# EAGLE design PasswordKeeper (EAGLE 7.6.0)
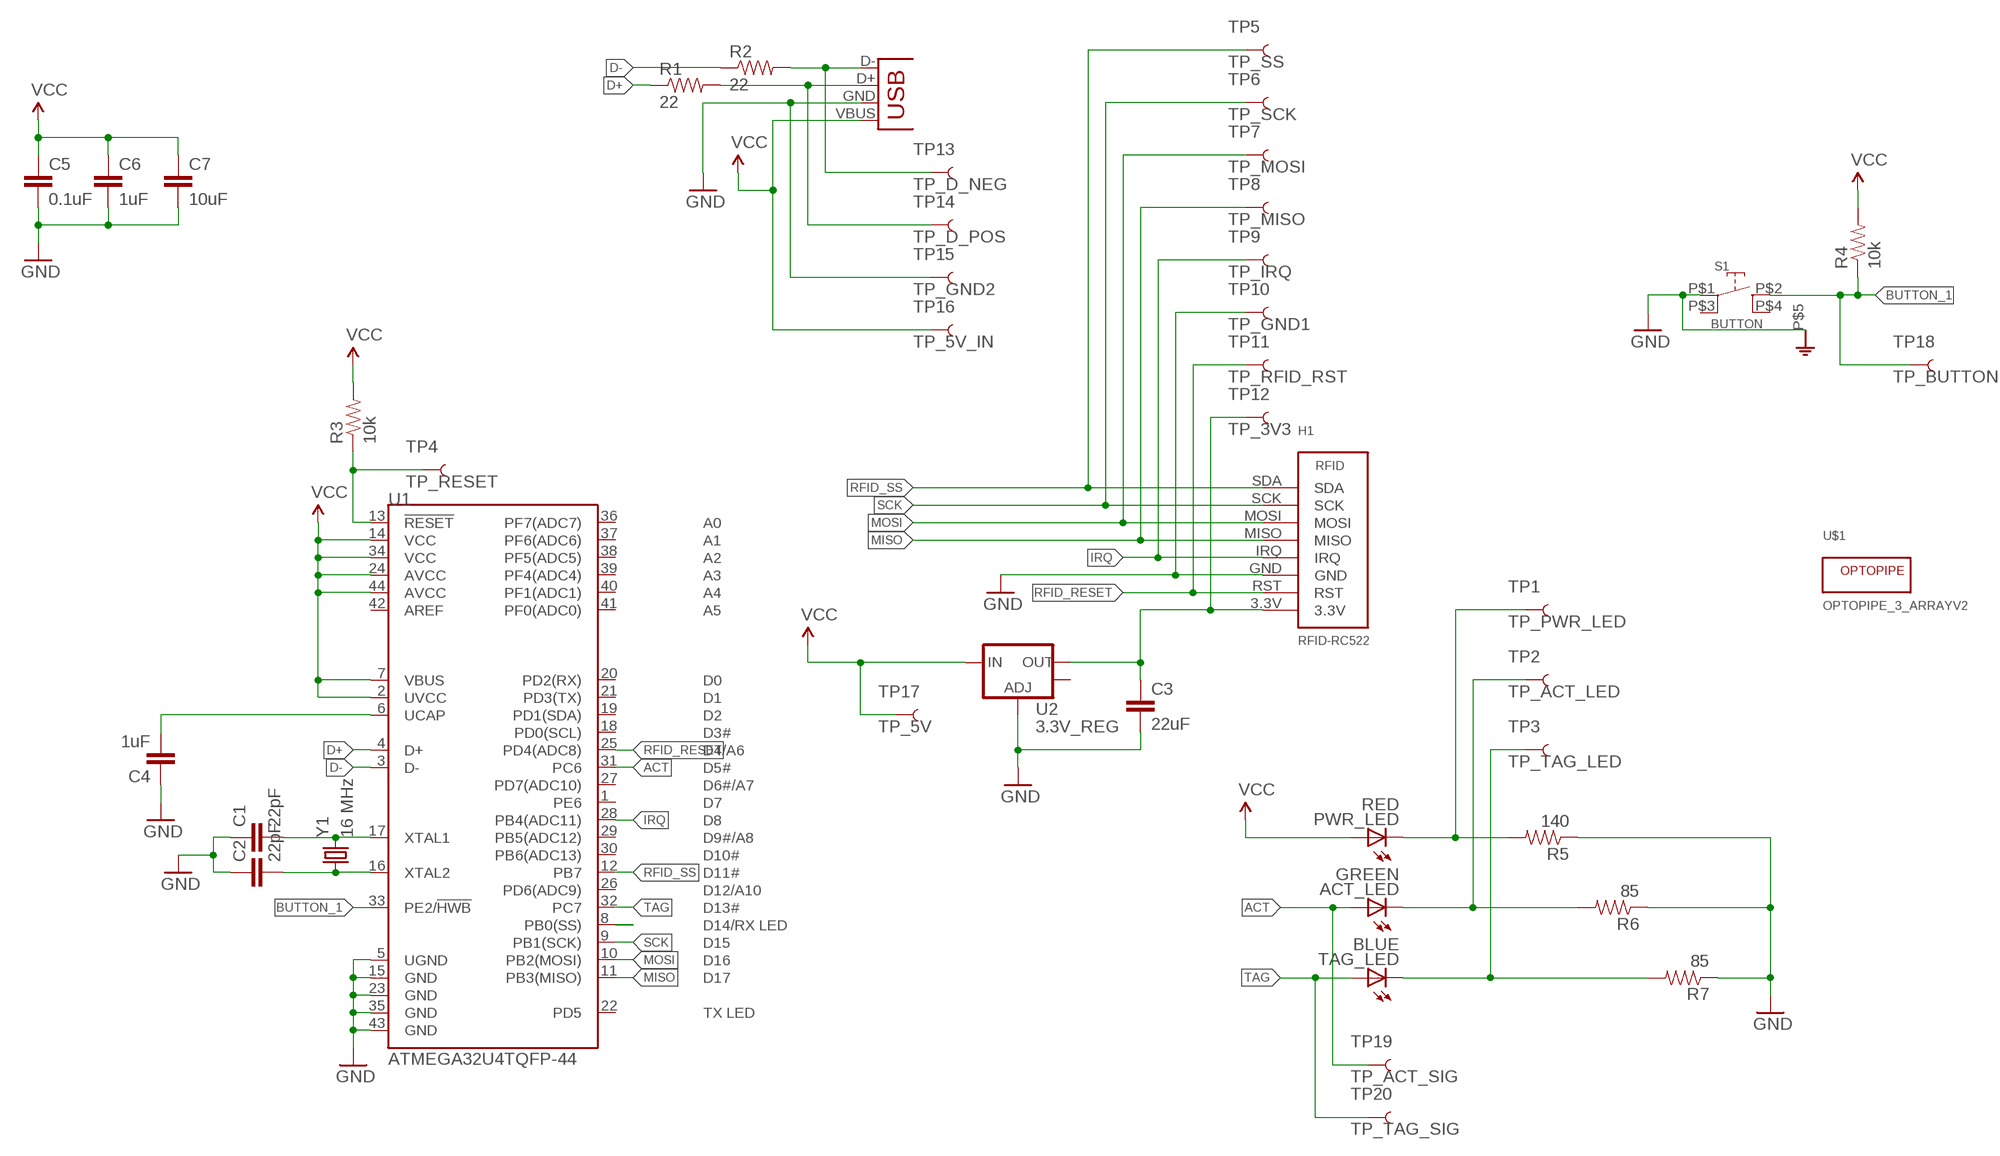
[diagram p0: schematic, sheet 1]

## Parts
ACT_LED  GREEN  LED1206  [LED-1206]
C1  22pF  CAP1206  [1206]
C2  22pF  CAP1206  [1206]
C3  22uF  22UF-0805-6.3V-20%  [0805]
C4  1uF  CAP1206  [1206]
C5  0.1uF  CAP1206  [1206]
C6  1uF  CAP1206  [1206]
C7  10uF  CAP1206  [1206]
H1  RFID-RC522  [EXT_RFID_READER]
JP1  USB-A-H  [USB-A-H]
PWR_LED  RED  LED1206  [LED-1206]
R1  22  RESISTOR1206  [1206]
R2  22  RESISTOR1206  [1206]
R3  10k  RESISTOR1206  [1206]
R4  10k  RESISTOR1206  [1206]
R5  140  RESISTOR1206  [1206]
R6  85  RESISTOR1206  [1206]
R7  85  RESISTOR1206  [1206]
S1  BUTTON  TACTILE_SWITCH_MOMENTARY_RIGHT_ANGLE  [TACTILE_SWITCH_SMD_RIGHT_ANGLE]
TAG_LED  BLUE  LED1206  [LED-1206]
TP1  TP_PWR_LED  TEST-POINTTP_15TH_THRU  [TP_15TH]
TP2  TP_ACT_LED  TEST-POINTTP_15TH_THRU  [TP_15TH]
TP3  TP_TAG_LED  TEST-POINTTP_15TH_THRU  [TP_15TH]
TP4  TP_RESET  TEST-POINTTP_15TH_THRU  [TP_15TH]
TP5  TP_SS  TEST-POINTTP_15TH_THRU  [TP_15TH]
TP6  TP_SCK  TEST-POINTTP_15TH_THRU  [TP_15TH]
TP7  TP_MOSI  TEST-POINTTP_15TH_THRU  [TP_15TH]
TP8  TP_MISO  TEST-POINTTP_15TH_THRU  [TP_15TH]
TP9  TP_IRQ  TEST-POINTTP_15TH_THRU  [TP_15TH]
TP10  TP_GND1  TEST-POINTTP_15TH_THRU  [TP_15TH]
TP11  TP_RFID_RST  TEST-POINTTP_15TH_THRU  [TP_15TH]
TP12  TP_3V3  TEST-POINTTP_15TH_THRU  [TP_15TH]
TP13  TP_D_NEG  TEST-POINTTP_15TH_THRU  [TP_15TH]
TP14  TP_D_POS  TEST-POINTTP_15TH_THRU  [TP_15TH]
TP15  TP_GND2  TEST-POINTTP_15TH_THRU  [TP_15TH]
TP16  TP_5V_IN  TEST-POINTTP_15TH_THRU  [TP_15TH]
TP17  TP_5V  TEST-POINTTP_15TH_THRU  [TP_15TH]
TP18  TP_BUTTON  TEST-POINTTP_15TH_THRU  [TP_15TH]
TP19  TP_ACT_SIG  TEST-POINTTP_15TH_THRU  [TP_15TH]
TP20  TP_TAG_SIG  TEST-POINTTP_15TH_THRU  [TP_15TH]
U1  ATMEGA32U4TQFP-44  [TQFP44]
U2  3.3V_REG  V_REG_LM1117SOT223  [SOT223]
U$1  OPTOPIPE_3_ARRAYV2  [515-1000_V2]
Y1  16 MHz  CRYSTALSMD  [HC49UP]

## Nets
3.3V: C3.1 H1.3.3V TP12.P$1 U2.2(OUT)
ACT: ACT_LED.A TP19.P$1 U1.31(PC6)
BUTTON_1: R4.1 S1.P$2 TP18.P$1 U1.33(PE2/!HWB)
D+: R1.1 U1.4(D+)
D-: R2.1 U1.3(D-)
GND: C1.1 C2.1 C3.2 C4.1 C5.2 C6.2 C7.2 H1.GND JP1.GND(VBUS) R5.1 R6.1 R7.1 S1.P$1 S1.P$5 TP10.P$1 TP15.P$1 U1.5(UGND) U1.15(GND) U1.23(GND) U1.35(GND) U1.43(GND) U2.1(ADJ)
IRQ: H1.IRQ TP9.P$1 U1.28(PB4(ADC11))
MISO: H1.MISO TP8.P$1 U1.11(PB3(MISO))
MOSI: H1.MOSI TP7.P$1 U1.10(PB2(MOSI))
N$1: JP1.D-(D+) R2.2 TP13.P$1
N$2: JP1.D+(D-) R1.2 TP14.P$1
N$3: C1.2 U1.17(XTAL1) Y1.2
N$4: C2.2 U1.16(XTAL2) Y1.1
N$7: C4.2 U1.6(UCAP)
N$9: PWR_LED.C R5.2 TP1.P$1
N$10: ACT_LED.C R6.2 TP2.P$1
N$11: R7.2 TAG_LED.C TP3.P$1
PROG_SS: U1.8(PB0(SS))
RESET: R3.1 TP4.P$1 U1.13(!RESET)
RFID_RESET: H1.RST TP11.P$1 U1.25(PD4(ADC8))
RFID_SS: H1.SDA TP5.P$1 U1.12(PB7)
SCK: H1.SCK TP6.P$1 U1.9(PB1(SCK))
TAG: TAG_LED.A TP20.P$1 U1.32(PC7)
VCC: C5.1 C6.1 C7.1 JP1.VBUS(GND) PWR_LED.A R3.2 R4.2 TP16.P$1 TP17.P$1 U1.2(UVCC) U1.7(VBUS) U1.14(VCC) U1.24(AVCC) U1.34(VCC) U1.44(AVCC) U2.3(IN)
Unconnected: S1.P$3 S1.P$4 U1.1(PE6) U1.18(PD0(SCL)) U1.19(PD1(SDA)) U1.20(PD2(RX)) U1.21(PD3(TX)) U1.22(PD5) U1.26(PD6(ADC9)) U1.27(PD7(ADC10)) U1.29(PB5(ADC12)) U1.30(PB6(ADC13)) U1.36(PF7(ADC7)) U1.37(PF6(ADC6)) U1.38(PF5(ADC5)) U1.39(PF4(ADC4)) U1.40(PF1(ADC1)) U1.41(PF0(ADC0)) U1.42(AREF) U2.4(OUT)

## Library data of the parts
ACT_LED PWR_LED TAG_LED = SparkFun-Retired:LED: LEDs Standard schematic elements and footprints for 5mm, 3mm, 1206, and 0603 sized LEDs. 5mm - Spark Fun Electronics SKU : Comp-SBL
C1 C2 C4-C7 = SparkFun-Passives:CAP: Capacitor Standard 0603 ceramic capacitor, and 0.1" leaded capacitor.
C3 = SparkFun-Capacitors:22UF: 22µF ceramic capacitors A capacitor is a passive two-terminal electrical component used to store electrical energy temporarily in an electric field.; PROD_ID: CAP-08402
H1 = ZnibbLib:RFID-RC522
JP1 = SparkFun-Connectors:USB: USB Connectors USB-B-PTH is fully proven SKU : PRT-00139/CONN-08278 USB-miniB is fully proven SKU : PRT-00587 USB-A-PCB is untested. USB-A-H is throughly reviewed, but untested. Spark Fun Electronics SKU : PRT-00437 USB-B-SMT is throughly reviewed, but untested. Needs silkscreen touching up. USB-A-S has not been used/tested USB-MB-H has not been used/tested USB-MICROB has been used. CONN-09505
R1-R7 = SparkFun-Passives:RESISTOR: Resistor Basic schematic elements and footprints for 0603, 1206, and PTH resistors.
S1 = ZnibbLib:TACTILE_SWITCH_MOMENTARY_RIGHT_ANGLE
TP1-TP20 = SparkFun-Connectors:TEST-POINT: SparkFun Test Points Bare copper test points for troubleshooting or In-Circuit-Testing. These are used by our Production team for verifying production board runs using pogo-pins on test beds. SparkFun Products: SparkFun LSM9DS1 Breakout <https://www.sparkfun.com/products/13284> SparkFun PSOC <https://www.sparkfun.com/products/13714> SparkFun Load Cell Amplifier <https://www.sparkfun.com/products/13879>
U1 = SparkFun-DigitalIC:ATMEGA32U4: Atmel 44-pin 8-bit Microcontroller with 32KBytes of ISP Flash and USB Controller
U2 = SparkFun-PowerIC:V_REG_LM1117: Voltage Regulator LM1117 Standard adjustable voltage regulator but in SMD form. Spark Fun Electronics SKU : COM-00595
U$1 = ZnibbLib:OPTOPIPE_3_ARRAY: OPTOPIPE, 3 array, 3x5.5mm rectangular This OptopipeTM is reliably held in place by 2 locating pins located between the light pipe elements. This OptopipeTM functions as a through-the-case indicator, and has a textured finish on the light emitting surface that increases its viewing angle. The recommended light sources are Dialight's 597 Series PLCC-2 or PLCC-4 Type SMT LEDs. The SMT LEDs are mounted in a straight line on a 0.420" pitch. The light pipe material is water clear transmissive polycarbonate rated UL94-V0, and has a 35% oxygen index.
Y1 = SparkFun-FreqCtrl:CRYSTAL: Various standard crystals. Proven footprints. Spark Fun Electronics SKU : COM-00534

## Board
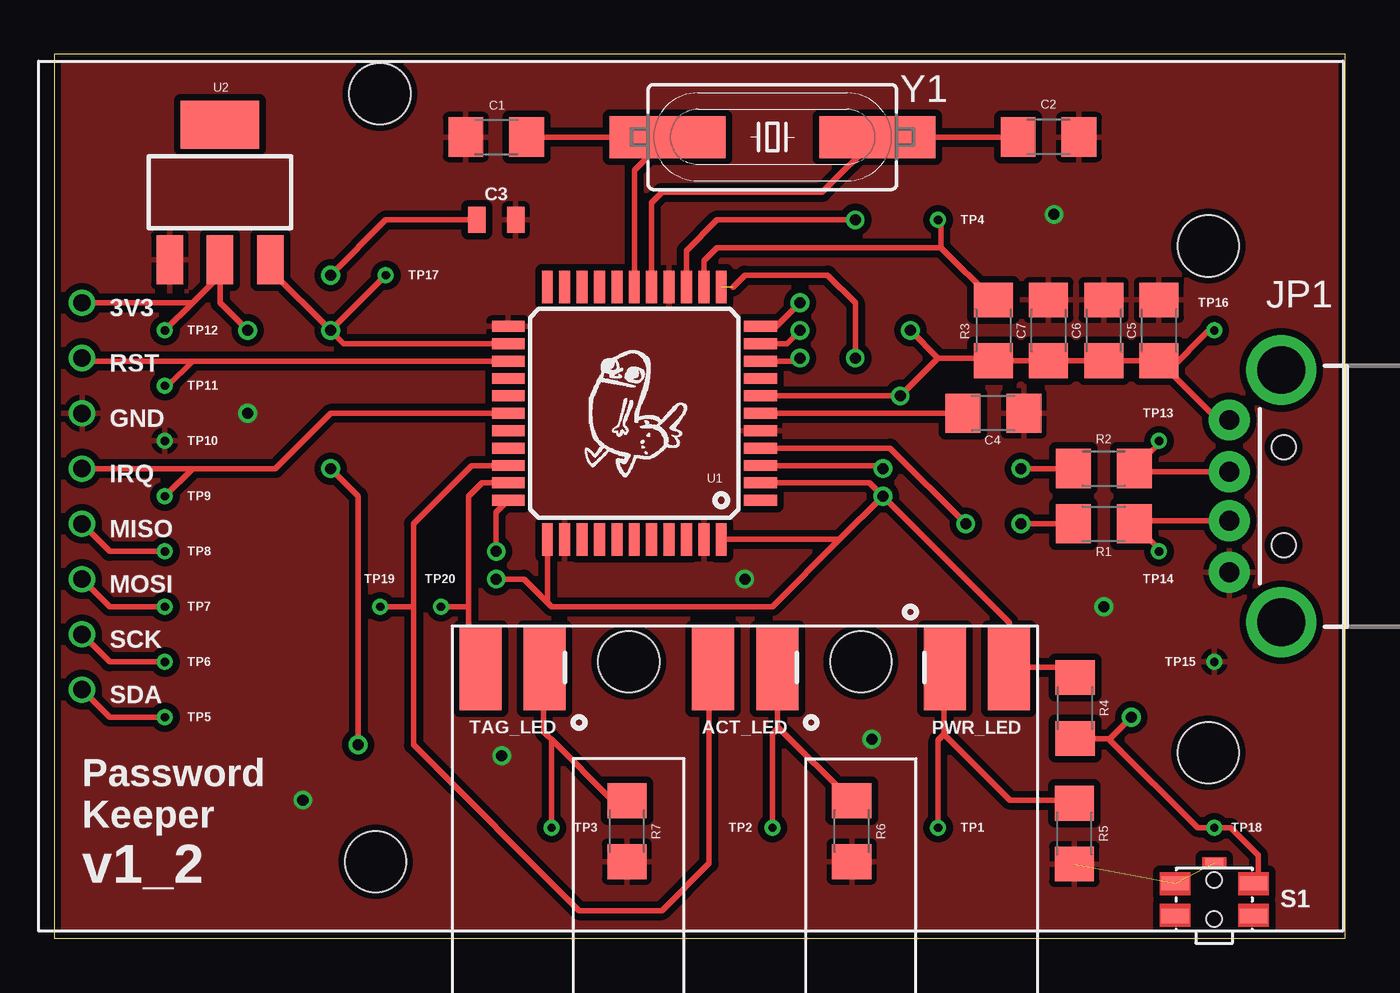
[diagram p1: board, top side]
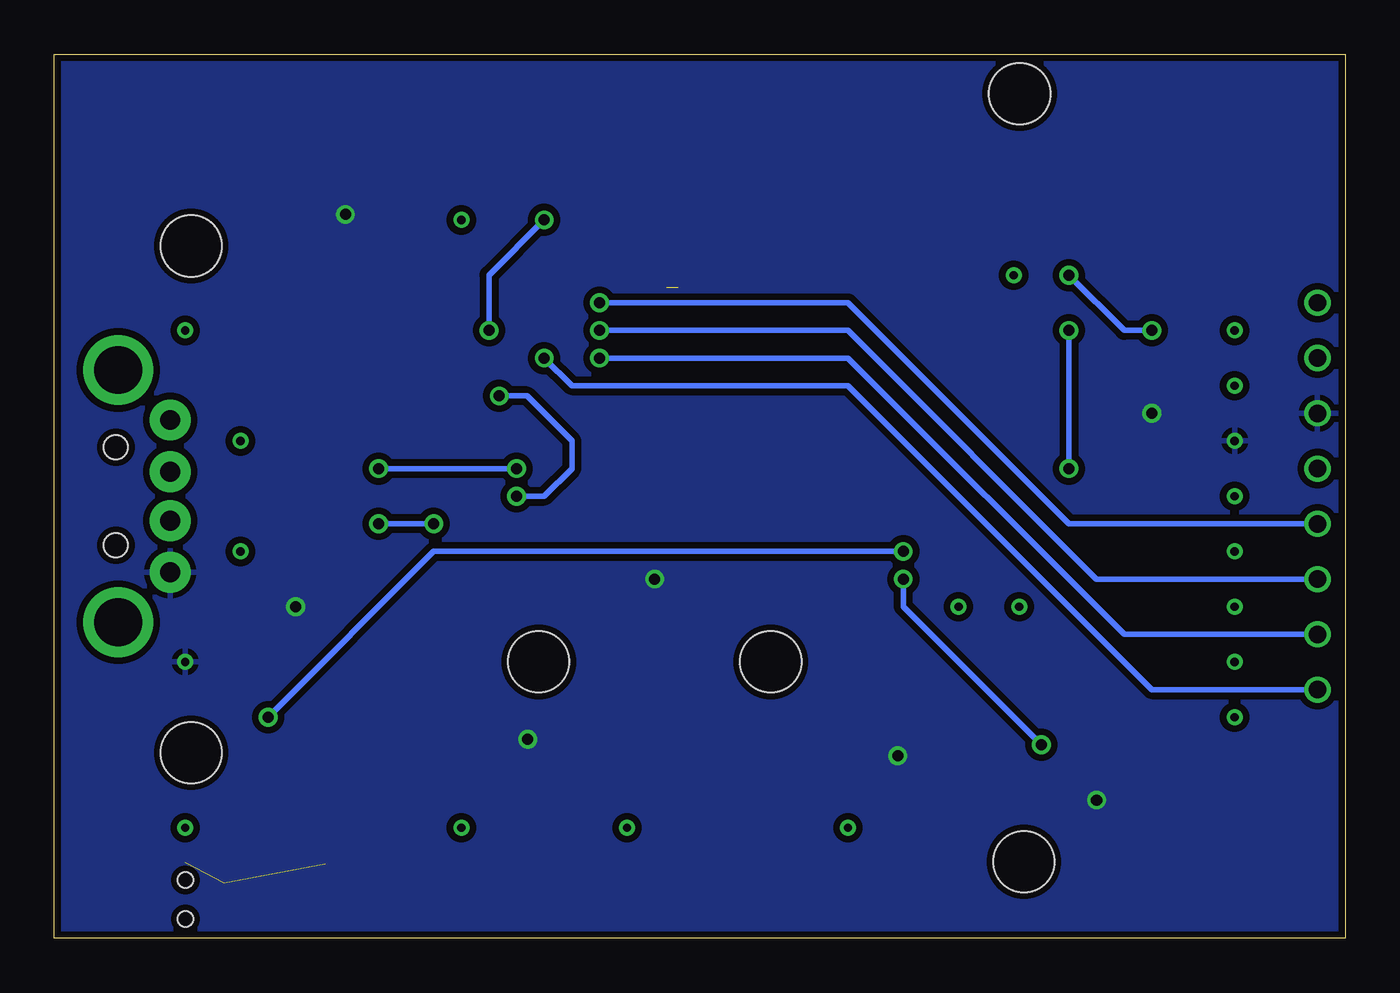
[diagram p2: board, bottom side, seen from below]

Size 59.36 x 40.63 mm. Coordinates in mm from the lower left corner, seen from the top.
Outline: 0,0 59.36,0 59.36,40.63 0,40.63 0,0
Copper layers (1*16): Top 0.035mm / dielectric 1.5mm / Bottom 0.035mm
Design rules "SparkFun-2-layer-TIGHT": minimum track width 7mil, minimum drill 15mil, track to track 7mil, track to pad 7mil, pad to pad 7mil, via to via 7mil, smd to smd 7mil, copper to edge 7mil, drill to drill 7mil, minimum pad ring 7mil, minimum via ring 7mil, stop-mask expansion 4mil, vias tented up to drill 25mil, thermal gap 10mil

### Footprints (pad centres in the part's own frame; a part is rotated, then mirrored left to right if it is on the bottom)
LED-1206 = smd 1.2 x 1.4: A -1.5,0; C 1.5,0
1206 = smd 1.6 x 1.8: 1 -1.4,0; 2 1.4,0
0805 = smd 0.8 x 1.2: 1 -0.9,0; 2 0.9,0
EXT_RFID_READER = drill 0.8: 3.3V 0,8.89; GND 0,3.81; IRQ 0,1.27; MISO 0,-1.27; MOSI 0,-3.81; RST 0,6.35; SCK 0,-6.35; SDA 0,-8.89 | hole 2.8: 13.7,18.5; 13.5,-16.8; 51.8,11.5; 51.8,-11.8
USB-A-H = drill 0.914 pad 1.88: D+ 2.4,1.127; D- 2.4,-1.127; GND 2.4,3.5; VBUS 2.4,-3.5 | drill 2.2: GND2 0,-5.8; GND3 0,5.8 | hole 1.1: -0.1,2.25; -0.1,-2.25
TACTILE_SWITCH_SMD_RIGHT_ANGLE = smd 1.27 x 0.66: P$1 -1.8,0.75; P$2 1.8,0.75; P$3 -1.8,-0.75; P$4 1.8,-0.75 | smd 0.813 x 0.406: P$5 0,1.7 | hole 0.7: 0,0.9; 0,-0.9
TP_15TH = drill 0.381 pad 0.61: P$1 0,0
TQFP44 = smd 1.5 x 0.5: 1 -5.8,4; 2 -5.8,3.2; 3 -5.8,2.4; 4 -5.8,1.6; 5 -5.8,0.8; 6 -5.8,0; 7 -5.8,-0.8; 8 -5.8,-1.6; 9 -5.8,-2.4; 10 -5.8,-3.2; 11 -5.8,-4; 23 5.8,-4; 24 5.8,-3.2; 25 5.8,-2.4; 26 5.8,-1.6; 27 5.8,-0.8; 28 5.8,0; 29 5.8,0.8; 30 5.8,1.6; 31 5.8,2.4; 32 5.8,3.2; 33 5.8,4 | smd 0.5 x 1.5: 12 -4,-5.8; 13 -3.2,-5.8; 14 -2.4,-5.8; 15 -1.6,-5.8; 16 -0.8,-5.8; 17 0,-5.8; 18 0.8,-5.8; 19 1.6,-5.8; 20 2.4,-5.8; 21 3.2,-5.8; 22 4,-5.8; 34 4,5.8; 35 3.2,5.8; 36 2.4,5.8; 37 1.6,5.8; 38 0.8,5.8; 39 0,5.8; 40 -0.8,5.8; 41 -1.6,5.8; 42 -2.4,5.8; 43 -3.2,5.8; 44 -4,5.8
SOT223 = smd 1.219 x 2.235: 1 -2.311,-3.099; 2 0,-3.099; 3 2.311,-3.099 | smd 3.6 x 2.2: 4 0,3.099
515-1000_V2 = smd 1.93 x 3.81: P$7 -12.15,-0.95; P$8 -9.2,-0.95; P$9 -1.5,-0.95; P$10 1.45,-0.95; P$11 9.2,-0.95; P$12 12.15,-0.95 | hole 2.8: -5.334,-1.27; 5.334,-1.27
HC49UP = smd 5.334 x 1.93: 1 -4.826,0; 2 4.826,0

### Placement (x,y rotation side)
ACT_LED  31.75,12.45 0 top
C1  20.32,36.83 0 top
C2  45.72,36.83 180 top
C3  20.32,33.02 0 top
C4  43.18,24.13 180 top
C5  50.8,27.94 90 top
C6  48.26,27.94 90 top
C7  45.72,27.94 90 top
H1  1.27,20.32 0 top
JP1  56.43,20.32 180 top
PWR_LED  42.42,12.45 180 top
R1  48.26,19.05 0 top
R2  48.26,21.59 0 top
R3  43.18,27.94 270 top
R4  46.94,10.58 90 top
R5  46.91,4.81 90 top
R6  36.67,4.92 90 top
R7  26.33,4.92 90 top
S1  53.34,1.78 0 top
TAG_LED  21.08,12.45 0 top
TP1  40.64,5.08 0 top
TP2  33.02,5.08 0 top
TP3  22.86,5.08 0 top
TP4  40.64,33.02 0 top
TP5  5.08,10.16 0 top
TP6  5.08,12.7 0 top
TP7  5.08,15.24 0 top
TP8  5.08,17.78 0 top
TP9  5.08,20.32 0 top
TP10  5.08,22.86 0 top
TP11  5.08,25.4 0 top
TP12  5.08,27.94 0 top
TP13  50.8,22.86 0 top
TP14  50.8,17.78 0 top
TP15  53.34,12.7 0 top
TP16  53.34,27.94 0 top
TP17  15.24,30.48 0 top
TP18  53.34,5.08 0 top
TP19  14.99,15.24 0 top
TP20  17.78,15.24 0 top
U1  26.67,24.13 180 top
U2  7.62,34.29 0 top
U$1  31.75,11.43 180 top
Y1  33.02,36.83 180 top

### Tracks (layer width: path | path; a pad name or v marks a point on that pad's centre or on a via)
3.3V  (via drill 0.51)
  Top 0.254: H1.3.3V 6.35,29.21 | 6.35,29.21 7.62,30.48 U2.2 7.62,29.21 v8.89,27.94 | v12.7,30.48 15.24,33.02 C3.1 | TP12.P$1 6.35,29.21
  Bottom 0.254: v8.89,27.94 10.16,27.94 v12.7,30.48
ACT
  Top 0.254: U1.31 19.19,21.73 16.51,19.05 16.51,15.24 | 16.51,15.24 16.51,8.89 24.13,1.27 27.94,1.27 30.11,3.44 30.11,12.31 ACT_LED.A | TP19.P$1 16.51,15.24
BUTTON_1  (via drill 0.51)
  Top 0.254: R4.1 48.55,9.18 | 48.55,9.18 v49.53,10.16 | v20.32,17.78 20.32,19.58 U1.33 | 48.55,9.18 48.55,9.11 52.58,5.08 TP18.P$1 54.1,5.08 55.37,3.81 55.37,2.51 S1.P$2
  Bottom 0.254: v49.53,10.16 41.91,17.78 v20.32,17.78
D+  (via drill 0.51)
  Top 0.254: U1.4 38.43,22.53 v41.91,19.05 | v44.45,19.05 R1.1
  Bottom 0.254: v41.91,19.05 v44.45,19.05
D-  (via drill 0.51)
  Top 0.254: U1.3 37.96,21.73 v38.1,21.59 | v44.45,21.59 R2.1
  Bottom 0.254: v38.1,21.59 v44.45,21.59
GND  (via drill 0.51)  (2 unrouted)
  other vias: 31.75,16.51 48.26,15.24 45.97,33.27 8.89,24.13 11.43,6.35 20.57,8.38 37.59,9.14
  pour Top (isolate 0.305): -2.54,41.91 -2.54,-1.27 60.96,-1.27 60.96,41.91
  pour Bottom (isolate 0.305): -3.81,43.18 -3.81,-2.54 62.23,-2.54 62.23,43.18
IRQ
  Top 0.254: U1.28 12.7,24.13 10.16,21.59 6.35,21.59 | 6.35,21.59 H1.IRQ | TP9.P$1 6.35,21.59
MISO  (via drill 0.51)
  Top 0.254: U1.11 33.21,28.13 v34.29,29.21 | TP8.P$1 2.54,17.78 H1.MISO
  Bottom 0.254: v34.29,29.21 22.86,29.21 12.7,19.05 H1.MISO
MOSI  (via drill 0.51)
  Top 0.254: U1.10 33.68,27.33 v34.29,27.94 | TP7.P$1 2.54,15.24 H1.MOSI
  Bottom 0.254: v34.29,27.94 22.86,27.94 11.43,16.51 H1.MOSI
N$1
  Top 0.254: JP1.D- 49.8,21.45 R2.2 50.8,22.73 TP13.P$1
N$2
  Top 0.254: JP1.D+ 49.8,19.19 R1.2 50.8,17.91 TP14.P$1
N$3
  Top 0.254: U1.17 26.67,35.31 Y1.2 C1.2
N$4
  Top 0.254: U1.16 27.47,33.82 27.94,34.29 35.31,34.29 Y1.1 C2.2
N$7
  Top 0.254: U1.6 C4.2
N$9
  Top 0.254: PWR_LED.C 40.92,9.37 | 40.92,9.37 43.94,6.35 46.77,6.35 R5.2 | TP1.P$1 40.64,9.1 40.92,9.37
N$10
  Top 0.254: ACT_LED.C 33.25,9.74 33.31,9.68 | 33.31,9.68 R6.2 | TP2.P$1 33.02,9.4 33.31,9.68
N$11
  Top 0.254: R7.2 25.68,6.32 22.86,9.14 | TAG_LED.C 22.5,12.36 22.5,9.5 22.73,9.27 22.86,9.14 | TP3.P$1 22.86,9.14
RESET
  Top 0.254: U1.13 29.87,31.14 30.48,31.75 40.77,31.75 | 40.77,31.75 R3.1 | 40.77,31.75 40.77,32.89 TP4.P$1
RFID_RESET
  Top 0.254: U1.25 6.35,26.53 | 6.35,26.53 1.41,26.53 H1.RST | TP11.P$1 5.22,25.4 6.35,26.53
RFID_SS  (via drill 0.51)  (1 unrouted)
  Top 0.254: 31.2,29.93 31.75,30.48 35.56,30.48 36.83,29.21 v36.83,26.67 | TP5.P$1 2.54,10.16 H1.SDA
  Bottom 0.254: v36.83,26.67 35.56,25.4 22.86,25.4 8.89,11.43 H1.SDA
SCK  (via drill 0.51)
  Top 0.254: U1.9 34.15,26.53 v34.29,26.67 | TP6.P$1 2.54,12.7 H1.SCK
  Bottom 0.254: v34.29,26.67 22.86,26.67 10.16,13.97 H1.SCK
TAG
  Top 0.254: U1.32 19.66,20.93 19.05,20.32 19.05,15.24 | 19.05,15.24 19.05,12.98 TAG_LED.A | TP20.P$1 19.05,15.24
VCC  (via drill 0.51)
  Top 0.254: U1.7 v38.9,24.93 40.64,26.67 | 40.64,26.67 43.05,26.67 R3.2 C7.1 C6.1 C5.1 51.24,26.1 | U1.14 29.07,31.61 30.48,33.02 v36.83,33.02 | v39.37,27.94 40.64,26.67 | v38.1,20.32 37.49,20.93 U1.2 | U1.44 36.11,18.33 | 36.11,18.33 v38.1,20.32 | U2.3 9.93,30.71 v12.7,27.94 | U1.34 22.67,15.43 | 22.67,15.43 22.86,15.24 33.02,15.24 36.11,18.33 | v20.32,16.51 21.59,16.51 22.67,15.43 | JP1.VBUS 53.52,23.82 51.24,26.1 | U1.24 13.31,27.33 v12.7,27.94 | v12.7,21.59 13.97,20.32 v13.97,8.89 | v38.1,20.32 43.92,14.5 PWR_LED.A 46.47,12.45 R4.2 46.54,12.38 | TP16.P$1 53.09,27.94 51.24,26.1 | v12.7,27.94 TP17.P$1
  Bottom 0.254: v38.1,20.32 36.83,20.32 35.56,21.59 35.56,22.86 37.63,24.93 v38.9,24.93 | v36.83,33.02 39.37,30.48 v39.37,27.94 | v13.97,8.89 20.32,15.24 v20.32,16.51 | v12.7,27.94 v12.7,21.59

### Text on the board
tPlace: TP4 | TP17 | 3V3 | TP16 | TP12 | RST | TP11 | TP13 | GND | TP10 | IRQ | TP9 | MISO | TP8 | TP19 | TP20 | TP14 | MOSI | TP7 | SCK | TP6 | TP15 | SDA | TP5 | Password / Keeper | TP3 | TP2 | TP1 | TP18 | v1_2
tNames: S1